# Altium schematic sheet CANBUS.SchDoc: Comunicación CAN BUS
size A4; Author: Agustin Zuliani; Revision: Rev: 00; SheetNumber: 3; SheetTotal: 7
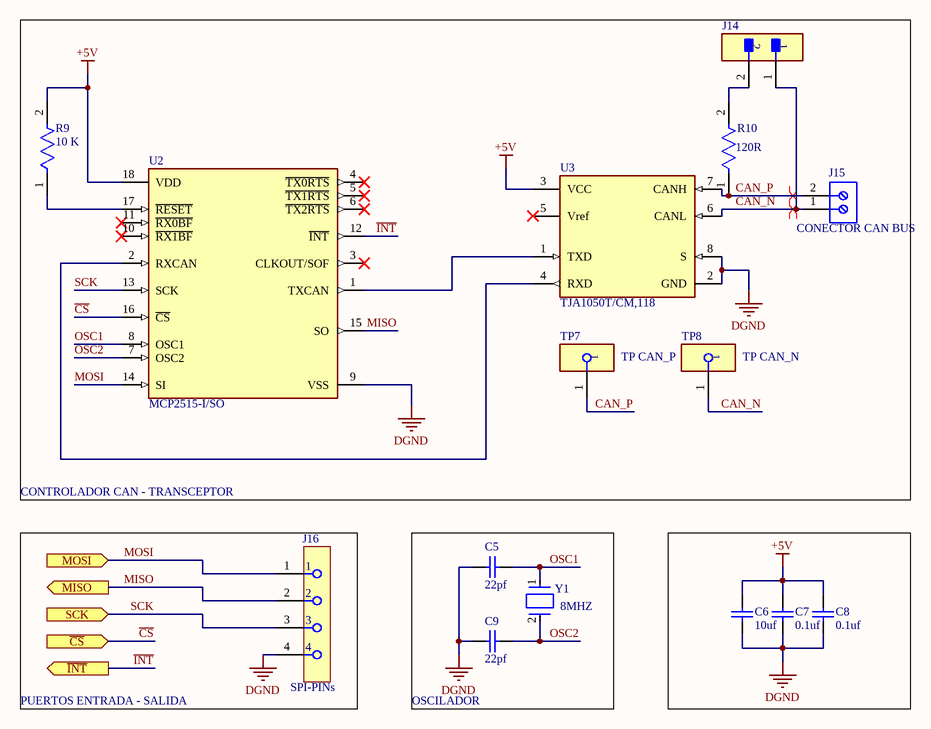
[diagram p0: CANBUS.SchDoc]

## Parts
C5  22pf  [CAPC2013X145X50NL20T25]
C6  10uf  [CAPC2013X145X50NL20T25]
C7  0.1uf  [CAPC2013X145X50NL20T25]
C8  0.1uf  [CAPC2013X145X50NL20T25]
C9  22pf  [CAPC2013X145X50NL20T25]
J14  TSW-102-07-F-S  [FP-TSW-102-07-F-S-MFG]  (value not drawn)
J15  CONECTOR CAN BUS  [691102710002]
J16  SPI-PINs  [FP-ESW-104-23-G-S-MFG]
R9  10 K  [FP-AC0805-MFG]
R10  120R  [FP-RN73R2A-IPC_A]
TP7  TP CAN_P  [FP-5004-MFG]
TP8  TP CAN_N  [FP-5004-MFG]
U2  MCP2515-I/SO  [FP-C04-051-MFG]
U3  TJA1050T/CM,118  [FP-SOT96-1-IPC_A]
Y1  8MHZ  [FP-ECS-80-20-4X-MFG]

## Blocks framed on the sheet
CONTROLADOR CAN - TRANSCEPTOR: J14 J15 R9 R10 TP7 TP8 U2 U3
PUERTOS ENTRADA - SALIDA: J16
OSCILADOR: C5 C9 Y1

## Ports
MISO (out), MOSI (in), SCK (in), ~{CS} (in), ~{INT} (out)

## Nets
+5V: C6.2 C7.2 C8.2 R9.2 U2.18(VDD) U3.3(VCC)
DGND: C5.1 C6.1 C7.1 C8.1 C9.1 J16.4 U2.9(VSS) U3.2(GND) U3.8(S)
~{CS}: U2.16(~{CS}) ; port ~{CS}
CAN_N: J14.1 J15.1 TP8.1 U3.6(CANL)
CAN_P: J15.2 R10.1 TP7.1 U3.7(CANH)
~{INT}: U2.12(~{INT}) ; port ~{INT}
MISO: J16.2 U2.15(SO) ; port MISO
MOSI: J16.1 U2.14(SI) ; port MOSI
OSC1: C5.2 U2.8(OSC1) Y1.1
OSC2: C9.2 U2.7(OSC2) Y1.2
SCK: J16.3 U2.13(SCK) ; port SCK
NetJ14_2: J14.2 R10.2
NetR9_1: R9.1 U2.17(~{RESET})
NetU2_1: U2.1(TXCAN) U3.1(TXD)
NetU2_2: U2.2(RXCAN) U3.4(RXD)

Not connected (* = marked no-connect by the designer): U2 3(CLKOUT/SOF)* 4(~{TX0RTS})* 5(~{TX1RTS})* 6(~{TX2RTS})* 10(~{RX1BF})* 11(~{RX0BF})*; U3 5(Vref)*

## Layout directives
differential pair: CAN_N, CAN_P

## Library data of the parts
C5 C9 = CMP-2007-01227-1: CAP 22pf 20% 0805; Manufacturer: Kemet; Part Number: C0805S104K5RACTU
C6 = CMP-2007-01227-1: CAP 10uf 20% 0805; Manufacturer: Kemet; Part Number: C0805S104K5RACTU
C7 C8 = CMP-2007-01227-1: CAP 100nf 20% 0805; Manufacturer: Kemet; Part Number: C0805S104K5RACTU
J14 = CMP-02766-001458-1: HEADER PINS 2 POS / Jumper de Res. Terminacion; Gender: Male; Max Current Rating: 7.6A; Number of Contacts: 2; Pitch: 2.54mm; Max Voltage Rating (AC): 550V; Orientation: Straight; Depth: 2.54mm; Series: TSW; Package Quantity: 1; Min Operating Temperature: -55°C; Max Operating Temperature: 125°C; Contact Type: Male Pin; Contact Shape: Square; Color: Black; Housing Color: Black; Connector Type: Header; Fastening Type: Pull; Radiation Hardening: No; Housing Material: Polyester; Mount: Through Hole; Number of Positions: 2; Number of Rows: 1; Contact Material: Bronze; Insulation Color: Black; Contact Finish - Mating: GOLD; Termination: Solder; Insulation Material: PBT; Length: 5.08mm; Flammability Rating: UL94 V-0; Contact Mating Length: 0.23inch; REACH SVHC: No SVHC; Contact Plating: Gold; RoHS Compliant: Yes; Packaging: Bulk
J15 = CMP-1502-03258-2: TERMINAL BLOCK 2 POS / Salida BUS CAN; NexarPartId: 8917706; Number of Levels: 1; Number of Positions Per Level: 2; Current: 15A; Voltage: 300V; Pitch: 5.0038mm; Plating: Steel; Stripping Length: -6mm; Wire Gauge (Min): 14AWG; Wire Gauge (Max): 22AWG; Length: 7.5mm; Contact Material: Brass; Contact Plating: Tin; Packaging: Box; Number of Pins: 2; Voltage Rating: 300V; Termination: Screw; Number of Contacts: 2; Color: Blue; Current Rating: 15A; Mount: Through Hole; Max Operating Temperature: 105°C; Min Operating Temperature: -40°C; REACH SVHC: Unknown; Height: 13.4mm; Width: 11.2mm; Housing Material: Nylon; RoHS: Compliant; Wire/Cable Gauge: 22AWG; Lead Pitch: 5mm
J16 = CMP-00575-09268283-1: HEADER PINS 4 POS / SPI Pins; Manufacturer Lifecycle Status: PRODUCTION; Contact Resistance: 10mΩ; Max Voltage Rating (AC): 550V; Current Rating: 5.2A; Max Current Rating: 6.9A; Number of Contacts: 4; Pitch: 2.54mm; Length: 10.67mm; Termination: Solder; Contact Material: Gold, Nickel; Orientation: Straight; Housing Material: Polyester; Max Operating Temperature: 125°C; Depth: 2.41mm; RoHS: Compliant; Housing Color: Black; Min Operating Temperature: -55°C; Number of Rows: 1; Height: 13.72mm; Radiation Hardening: No; Lifecycle Status: Production; Contact Plating: Gold
R9 = CMP-2001-04494-2: RES 10K 5% 0805; Manufacturer Part Number: AC0805FR-072K2L; Manufacturer: Yageo; Value: 2.2KΩ; Automotive Grade: Grade 0; Voltage Rating: 150V; Tolerance: 0.01; Power Rating: 1/8W; Series: AC; Category: Res; Device Class L1: Passive Components; Digikey Description: RES SMD 2.2K OHM 1% 1/8W 0805; Mouser Description: Thick Film Resistors - SMD 1/8W 2.2K ohm 1% AEC-Q200; ComponentLink2Description: Datasheet; Composition: Thick Film; Height: 0.6mm; Temperature Range High: +155°C; Temperature Range Low: -55°C; Package: AC0805; Temperature: -55°C to +155°C; RoHS: TRUE; Ipc Land Pattern Name: RESC200125X50; Footprint Url: http://www.yageo.com/exep/pages/download/literatures/PYu-R_Mount_10.pdf; ComponentLink2URL: http://www.yageo.com/documents/recent/PYu-AC_51_RoHS_L_6.pdf; Resistance: 2.2KΩ; Automotive: Yes; Device Class L2: Resistors; Device Class L3: Chip SMD Resistors; Octopart: https://octopart.com/ac0805fr-072k2l-yageo-26041153; Lead Free: Yes
R10 = CMP-04015-052084-1: RES 120R 5% 0805 / Resistencia de terminacion
TP7 TP8 = CMP-2000-05575-2: PC TEST POINT MINIATURE YELLOW; Manufacturer: Keystone; Manufacturer Part Number: 5004; Number Of Contacts: 1; Is Female: yes; Device Class L1: Connectors; Digikey Description: PC TEST POINT MINIATURE YELLOW; ComponentLink2URL: https://www.keyelco.com/product-pdf.cfm?p=1313; Lead Free: Yes; ComponentLink2Description: Datasheet; Category: Conn; Height: 4.72mm; Octopart: https://octopart.com/5004-keystone-28591; Mouser Description: TEST POINT PC MINI .040"D YELLOW; Device Class L3: unset; Contact Material: Silver; Package: 5004; Automotive: No; Device Class L2: unset; RoHS: TRUE
U2 = CMP-0186-00133-3: CI MCP2515 SOIC18; Manufacturer: Microchip; Min Supply Voltage: 2.7V; Function: Controller; Max Supply Voltage: 5.5V; Standoff Height: 0.1mm; Nominal Supply Current: 10mA; Interface: SPI,CAN; Lead Free: Yes; Digikey Description: IC CAN CONTROLLER W/SPI 18SOIC; Category: IC; RoHS: TRUE; Manufacturer Part Number: MCP2515-I/SO; ComponentLink2URL: http://ww1.microchip.com/downloads/en/DeviceDoc/MCP2515-Stand-Alone-CAN-Controller-with-SPI-20001801J.pdf; Mouser Description: CAN Interface IC W/ SPI Interface; Device Class L2: Interface ICs; Package: C04-051; Automotive: No; Octopart: https://octopart.com/mcp2515-i%2Fso-microchip-430187; Temperature: -40°C to +85°C; Ipc Land Pattern Name: SOIC127P1030X265-18; Ambient Temperature Range Low: -65°C; Height: 2.65mm; Device Class L1: Integrated Circuits (ICs); Ambient Temperature Range High: +125°C; Footprint Url: http://ww1.microchip.com/downloads/en/DeviceDoc/18L_SOIC_Wide_7.50_SO_C04-0051D.pdf; Temperature Range Low: -40°C; Device Class L3: Controllers; Temperature Range High: +85°C; ComponentLink2Description: Datasheet
U3 = CMP-2000-04923-2: CI TJA1050 TRANSCEIVER SOIC8; Simplex/Duplex: Half Duplex; Max Supply Current: 10mA; Number of Receive Buffers: 1; Min Supply Voltage: 4.75V; Max Supply Voltage: 5.25V; Interface: CAN; Data Rate: 1Mbps; Receiver Hysteresis: 70mV; Number of Transmit Buffers: 1; Min Operating Temperature: -40°C; Case/Package: SO; REACH SVHC: No SVHC; Max Operating Temperature: 150°C; Number of Pins: 8; Lead Free: Lead Free; Number of Transceivers: 1; Packaging: Tape and Reel; Mount: Surface Mount; Radiation Hardening: No; Nominal Supply Current: 10mA; Package Quantity: 2500; Contact Plating: Gold
Y1 = CMP-1669-00002-3: CRYSTAL 8 MHz / CAN BUS; NexarPartId: 316504; Frequency Stability: 50ppm; ESR (Equivalent Series Resistance): 80Ω; Tolerance: 0.003%; Load Capacitance: 20pF; Schedule B: 8541600025, 8541600025; Number of Pins: 49; Max Operating Temperature: 70°C; Lead Free: Lead Free; Height: 3.5mm; Termination: Radial; Frequency: 8MHz; RoHS: Compliant; Frequency Tolerance: 0.003%; Packaging: Bulk; Mount: Through Hole; Width: 4.65mm; Length: 11.3538mm; Min Operating Temperature: -10°C